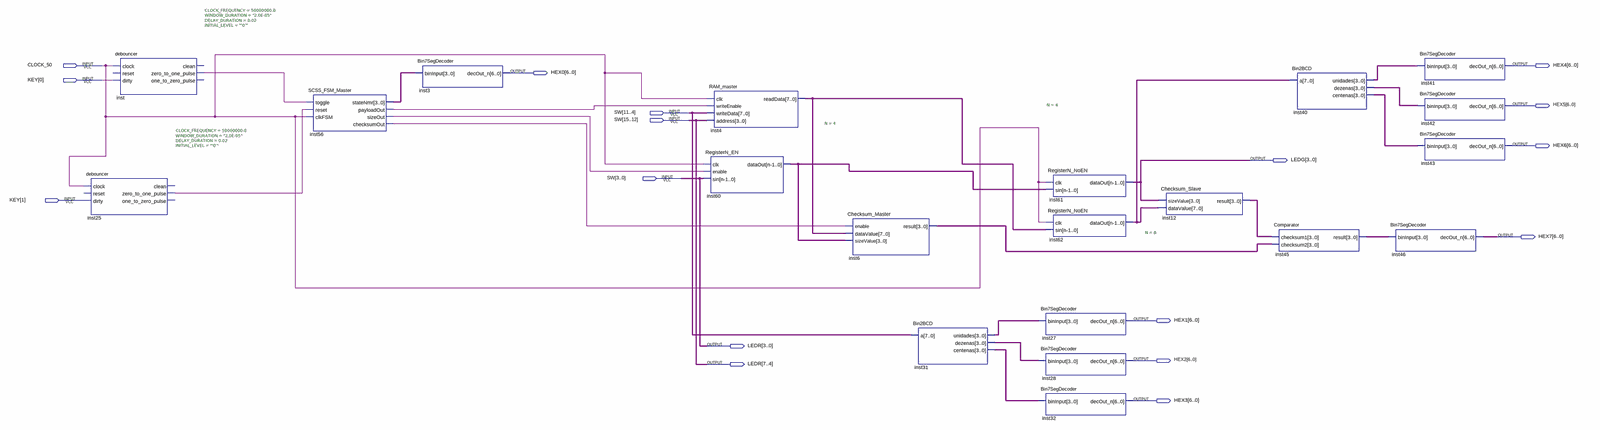
[diagram p0: schematic sheet, whole]
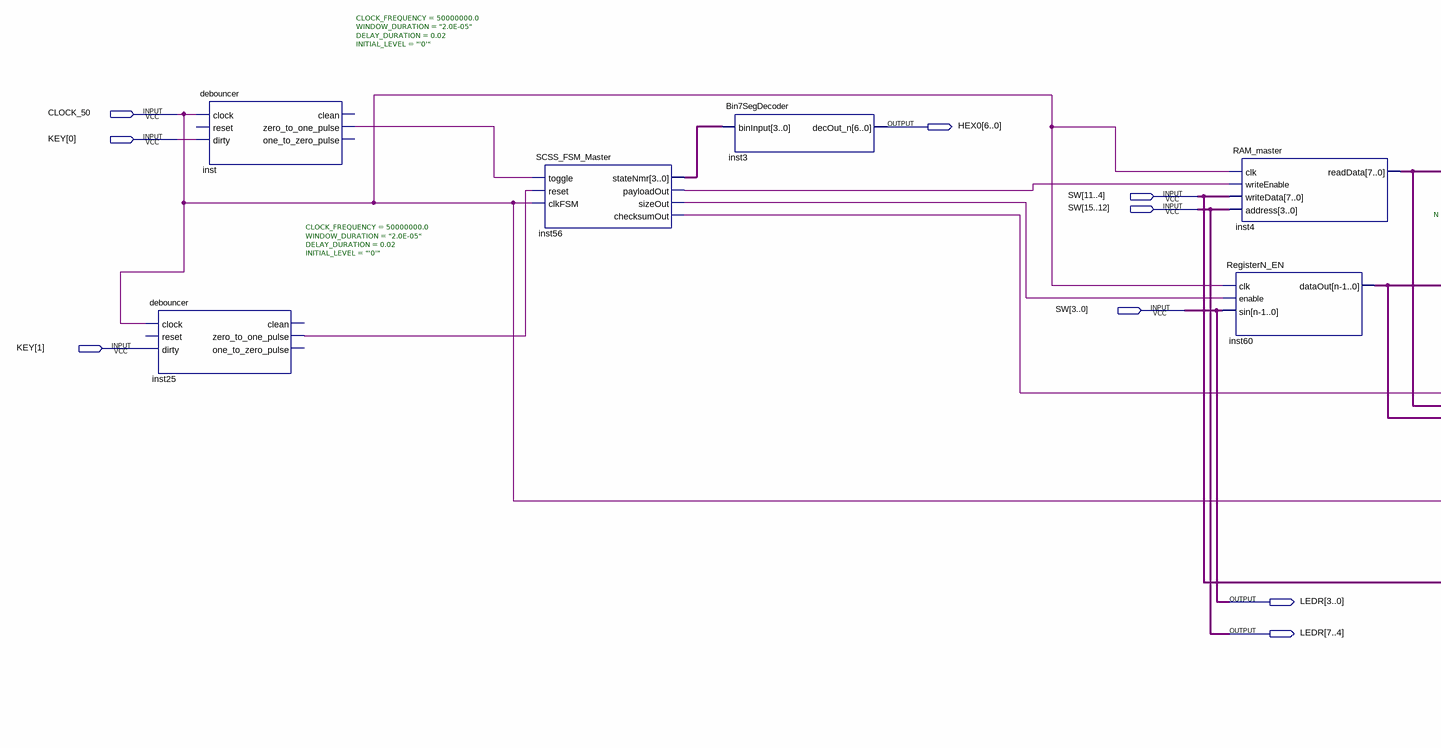
[diagram p1: schematic sheet, left part]
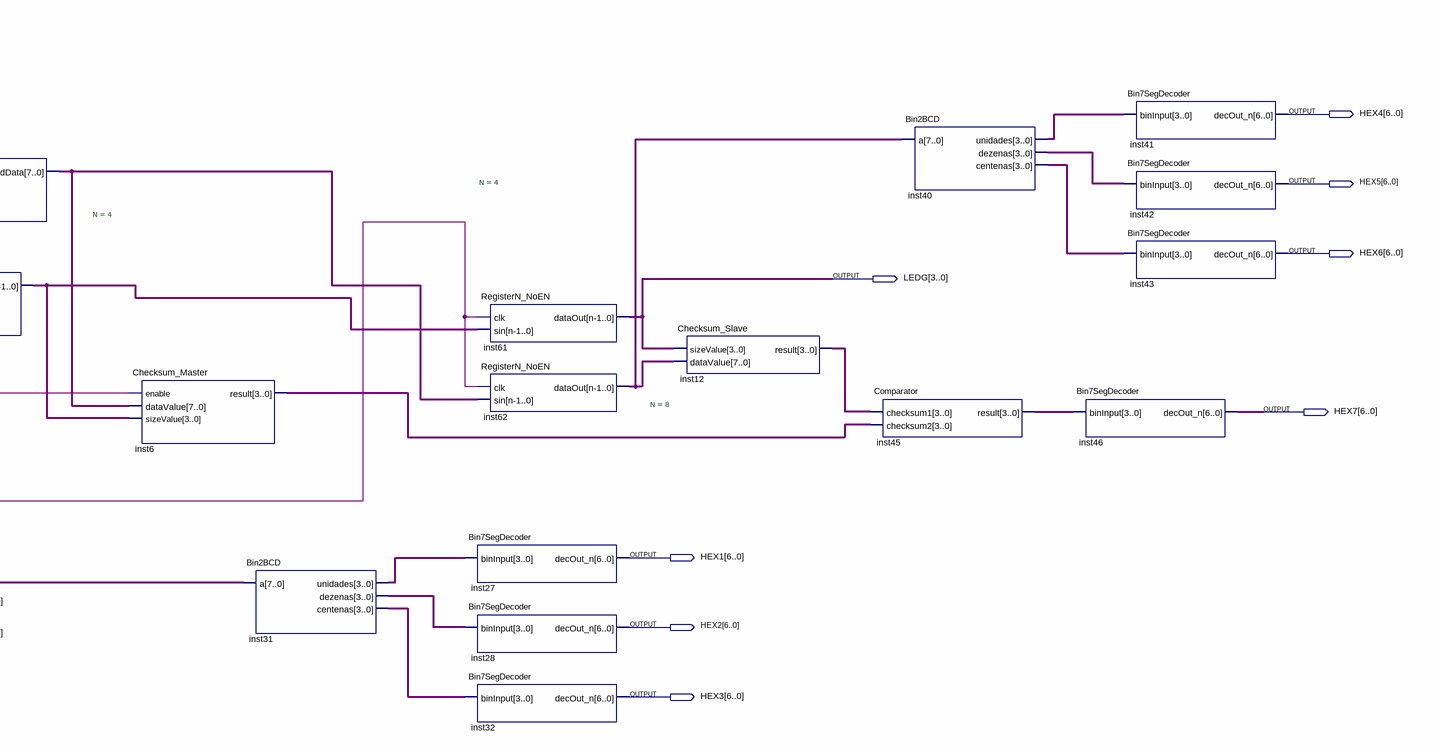
[diagram p2: schematic sheet, right part]
// Quartus schematic SCSS_DEMO.bdf as structural Verilog: 20 symbols, 17 pins
module SCSS_DEMO (
  input  CLOCK_50,
  input  [1:0] KEY,
  input  [15:0] SW,
  output [6:0] HEX4,
  output [6:0] HEX0,
  output [6:0] HEX5,
  output [6:0] HEX6,
  output [3:0] LEDG,
  output [6:0] HEX7,
  output [6:0] HEX1,
  output [7:0] LEDR,
  output [6:0] HEX2,
  output [6:0] HEX3
);

  wire inst25_zero_to_one_pulse, inst56_checksumout, inst56_payloadout, inst56_sizeout,
       inst_zero_to_one_pulse;
  wire [3:0] inst6_result, inst12_result, inst31_centenas, inst31_dezenas, inst31_unidades, inst40_centenas,
       inst40_dezenas, inst40_unidades, inst45_result, inst56_statenmr, inst60_dataout;
  wire [7:0] inst4_readdata, inst62_dataout;

  debouncer #(.CLOCK_FREQUENCY(50000000.0), .WINDOW_DURATION("2.0E-05"), .DELAY_DURATION(0.02), .INITIAL_LEVEL("'0'")) inst25 (
    .clock(CLOCK_50), .dirty(KEY[1]), .zero_to_one_pulse(inst25_zero_to_one_pulse));  // open: reset, clean, one_to_zero_pulse
  debouncer #(.CLOCK_FREQUENCY(50000000.0), .WINDOW_DURATION("2.0E-05"), .DELAY_DURATION(0.02), .INITIAL_LEVEL("'0'")) inst (
    .clock(CLOCK_50), .dirty(KEY[0]), .zero_to_one_pulse(inst_zero_to_one_pulse));  // open: reset, clean, one_to_zero_pulse
  SCSS_FSM_Master inst56 (
    .toggle(inst_zero_to_one_pulse), .reset(inst25_zero_to_one_pulse), .clkFSM(CLOCK_50),
    .stateNmr(inst56_statenmr), .payloadOut(inst56_payloadout), .sizeOut(inst56_sizeout),
    .checksumOut(inst56_checksumout));
  Bin7SegDecoder inst3 (.binInput(inst56_statenmr), .decOut_n(HEX0));
  RAM_master inst4 (
    .clk(CLOCK_50), .writeEnable(inst56_payloadout), .writeData(SW[11:4]), .address(SW[15:12]),
    .readData(inst4_readdata));
  RegisterN_EN #(.N(4)) inst60 (.clk(CLOCK_50), .enable(inst56_sizeout), .sin(SW[3:0]), .dataOut(inst60_dataout));
  Checksum_Master inst6 (
    .enable(inst56_checksumout), .dataValue(inst4_readdata), .sizeValue(inst60_dataout), .result(inst6_result));
  Bin2BCD inst31 (.a(SW[11:4]), .unidades(inst31_unidades), .dezenas(inst31_dezenas), .centenas(inst31_centenas));
  RegisterN_NoEN #(.N(4)) inst61 (.clk(CLOCK_50), .sin(inst60_dataout), .dataOut(LEDG));
  RegisterN_NoEN #(.N(8)) inst62 (.clk(CLOCK_50), .sin(inst4_readdata), .dataOut(inst62_dataout));
  Bin7SegDecoder inst27 (.binInput(inst31_unidades), .decOut_n(HEX1));
  Bin7SegDecoder inst28 (.binInput(inst31_dezenas), .decOut_n(HEX2));
  Bin7SegDecoder inst32 (.binInput(inst31_centenas), .decOut_n(HEX3));
  Checksum_Slave inst12 (.sizeValue(LEDG), .dataValue(inst62_dataout), .result(inst12_result));
  Bin2BCD inst40 (.a(inst62_dataout), .unidades(inst40_unidades), .dezenas(inst40_dezenas), .centenas(inst40_centenas));
  Comparator inst45 (.checksum1(inst12_result), .checksum2(inst6_result), .result(inst45_result));
  Bin7SegDecoder inst46 (.binInput(inst45_result), .decOut_n(HEX7));
  Bin7SegDecoder inst41 (.binInput(inst40_unidades), .decOut_n(HEX4));
  Bin7SegDecoder inst42 (.binInput(inst40_dezenas), .decOut_n(HEX5));
  Bin7SegDecoder inst43 (.binInput(inst40_centenas), .decOut_n(HEX6));

  assign LEDR = {SW[15:12], SW[3:0]};
endmodule
